# Altium schematic sheet Sheet1.SchDoc
size B
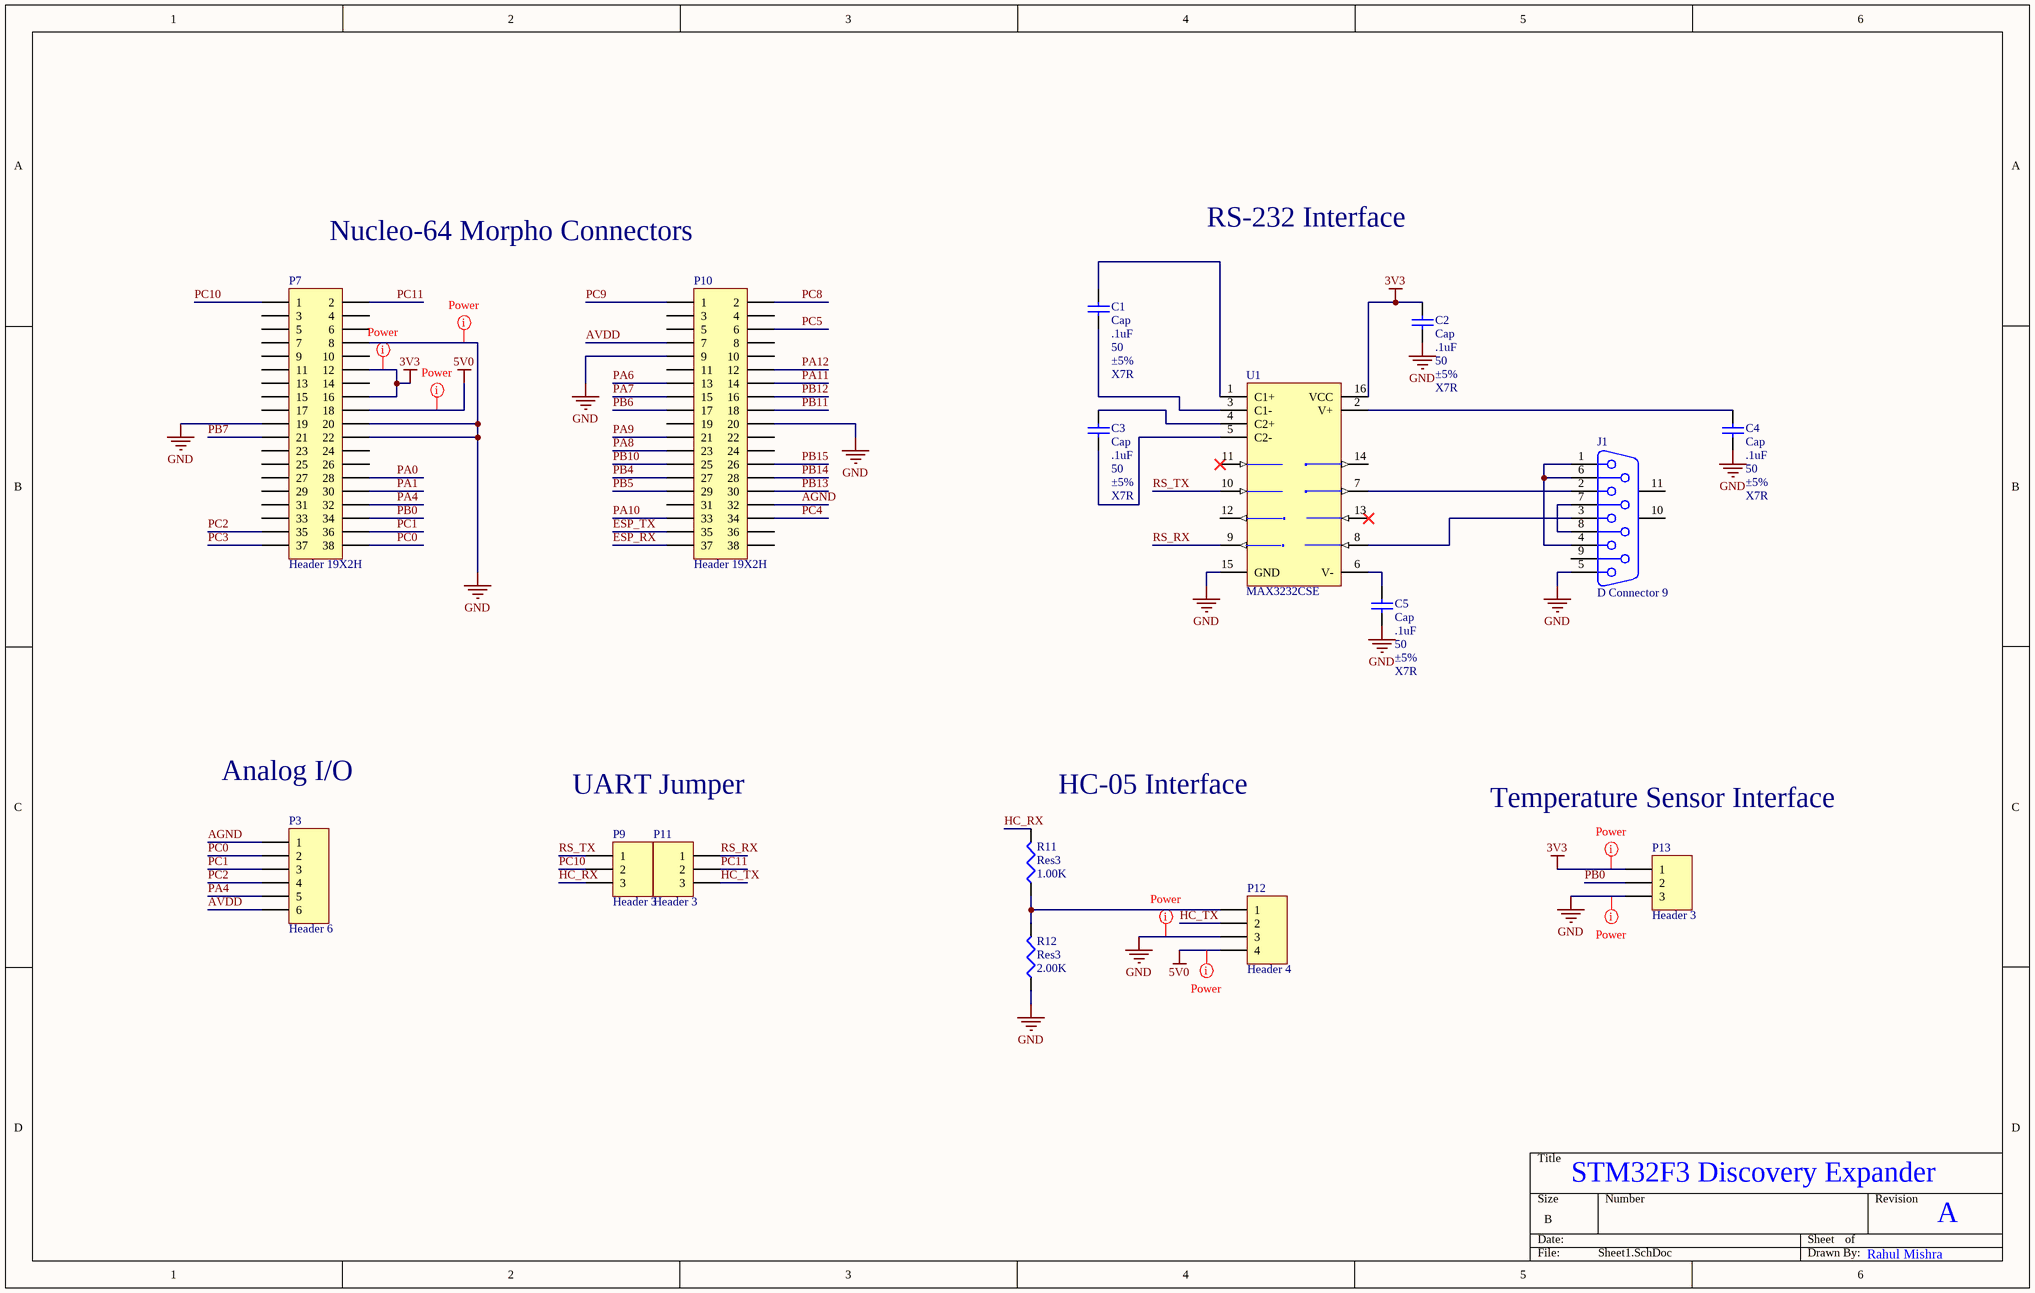
[diagram p0: Sheet1.SchDoc]

## Parts
C1  Cap  value .1uF  WV: 50  Tolerance: ±5%  Type: X7R  [CAPC2012X09M]
C2  Cap  value .1uF  WV: 50  Tolerance: ±5%  Type: X7R  [CAPC2012X09M]
C3  Cap  value .1uF  WV: 50  Tolerance: ±5%  Type: X7R  [CAPC2012X09M]
C4  Cap  value .1uF  WV: 50  Tolerance: ±5%  Type: X7R  [CAPC2012X09M]
C5  Cap  value .1uF  WV: 50  Tolerance: ±5%  Type: X7R  [CAPC2012X09M]
J1  D Connector 9  [DSUB1.385-2H9]
P3  Header 6  [HDR1X6]
P7  Header 19X2H  [PPPC192LFBN-RC]
P9  Header 3  [HDR1X3]
P10  Header 19X2H  [PPPC192LFBN-RC]
P11  Header 3  [HDR1X3]
P12  Header 4  [HDR1X4]
P13  Header 3  [HDR1X3]
R11  Res3  value 1.00K  [RESC2112X05M]
R12  Res3  value 2.00K  [RESC2112X05M]
U1  MAX3232CSE  [NSO16_N]

## Nets
3V3: C2.2 P7.12 P7.16 P13.1 U1.16(VCC)
5V0: P7.18 P12.4
GND: C2.1 C4.1 C5.1 J1.5 P7.8 P7.19 P7.20 P7.22 P10.9 P10.20 P12.3 P13.3 R12.1 U1.15(GND)
AGND: P3.1 P10.32
AVDD: P3.6 P10.7
ESP_RX: P10.37
ESP_TX: P10.35
HC_RX: P9.3 R11.2
HC_TX: P11.3 P12.2
PA0: P7.28
PA1: P7.30
PA4: P3.5 P7.32
PA6: P10.13
PA7: P10.15
PA8: P10.23
PA9: P10.21
PA10: P10.33
PA11: P10.14
PA12: P10.12
PB0: P7.34 P13.2
PB4: P10.27
PB5: P10.29
PB6: P10.17
PB7: P7.21
PB10: P10.25
PB11: P10.18
PB12: P10.16
PB13: P10.30
PB14: P10.28
PB15: P10.26
PC0: P3.2 P7.38
PC1: P3.3 P7.36
PC2: P3.4 P7.35
PC3: P7.37
PC4: P10.34
PC5: P10.6
PC8: P10.2
PC9: P10.1
PC10: P7.1 P9.2
PC11: P7.2 P11.2
RS_RX: P11.1 U1.9(R2OUT)
RS_TX: P9.1 U1.10(T2IN)
NetC1_1: C1.1 U1.3(C1-)
NetC1_2: C1.2 U1.1(C1+)
NetC3_1: C3.1 U1.5(C2-)
NetC3_2: C3.2 U1.4(C2+)
NetC4_2: C4.2 U1.2(V+)
NetC5_2: C5.2 U1.6(V-)
NetJ1_1: J1.1 J1.4 J1.6
NetJ1_2: J1.2 U1.7(T2OUT)
NetJ1_3: J1.3 U1.8(R2IN)
NetJ1_7: J1.7 J1.8
NetP12_1: P12.1 R11.1 R12.2

Not connected (* = marked no-connect by the designer): J1 9 10(MH1) 11(MH2); P7 3 4 5 6 7 9 10 11 13 14 15 17 23 24 25 26 27 29 31 33; P10 3 4 5 8 10 11 19 22 24 31 36 38; U1 11(T1IN)* 12(R1OUT) 13(R1IN)* 14(T1OUT)

## Layout directives
net class Power: 3V3, 5V0, GND

## Notes on the sheet
- RS-232 Interface
- Nucleo-64 Morpho Connectors
- Analog I/O
- UART Jumper
- (near R11) HC-05 Interface
- Temperature Sensor Interface
- STM32F3 Discovery Expander
- A
- Rahul Mishra

## Library data of the parts
C1-C5 = CAP-X7R-.1uF-50V-±5%: CAP CER .1uF 50v X7R 0805; MPN: C0805C104J5RACTU; PN: 399-1171-1-ND; Name: CAP-X7R-.1uF-50V-±5%; URL: http://www.digikey.ca/product-detail/en/C0805C104J5RACTU/399-1171-1-ND
J1 = D Connector 9: Receptacle Assembly, 9 Position, Right Angle; MPN: ADF09A-KG-TASB3-R; PN: AE10921-ND; URL: http://www.digikey.ca/product-detail/en/ADF09A-KG-TASB3-R/AE10921-ND
P3 = Header 6: Header, 6-Pin Male; MPN: PEC06SFAN; PN: S1212E-06-ND; URL: http://www.digikey.ca/product-detail/en/PEC06SFAN/S1212E-06-ND
P7 P10 = Header 19X2H: 38 Position Header Connector 0.100in (2.54mm) Through Hole Gold; PN: S7122-ND; URL: https://www.digikey.ca/product-detail/en/sullins-connector-solutions/PPPC192LFBN-RC/S7122-ND; MPN: PPPC192LFBN-RC
P9 P11 P13 = Header 3: Header, 3-Pin Male; MPN: PEC03SFAN; PN: S1212E-03-ND; URL: http://www.digikey.ca/product-detail/en/PEC03SFAN/S1212E-03-ND
P12 = Header 4: Header, 4-Pin Male; MPN: PEC04SFAN; PN: S1212E-04-ND; URL: http://www.digikey.ca/product-detail/en/PEC04SFAN/S1212E-04-ND
R11 = Resistor_1.00K: RES SMD 1.00K OHM 1% 1/8W 0805; MPN: CRCW08051K00FKEA; PN: 541-1.00KCCT-ND; Name: Resistor_1.00K; URL: http://www.digikey.ca/product-detail/en/CRCW08051K00FKEA/541-1.00KCCT-ND
R12 = Resistor_2.00K: RES SMD 2.00K OHM 1% 1/8W 0805; MPN: CRCW08052K00FKEA; PN: 541-2.00KCCT-ND; Name: Resistor_2.00K; URL: http://www.digikey.ca/product-detail/en/CRCW08052K00FKEA/541-2.00KCCT-ND
U1 = MAX3232CSE: 3.0V TO 5.5V, Low-Power, up to 1Mbps, True RS-232 Transceiver Using Four 0.1µF External Capacitor; MPN: MAX3232CSE+; PN: MAX3232CSE+-ND; Published: 16-Jan-2001; LatestRevisionDate: 13-Apr-2006; LatestRevisionNote: IPC-7351 Footprint Added.; DatasheetVersion: Mar-1999; PackageReference: NSO16; Publisher: Altium Limited; PackageDescription: 16-Pin Small Outline Integrated Circuit 1.27 mm Pitch; Code_JEDEC: MS-012-AC; Code_IPC: SOIC127P600-16; ComponentLink1Description: Manufacturer Link; ComponentLink1URL: http://www.maxim-ic.com/; ComponentLink2Description: Datasheet; ComponentLink2URL: http://pdfserv.maxim-ic.com/en/ds/MAX3222-MAX3241.pdf; URL: http://www.digikey.ca/product-detail/en/MAX3232CSE%2B/MAX3232CSE%2B-ND